# Altium schematic sheet MOTOR.SchDoc
size A4; Author: Khanh BK; Organization: DB Bach Khoa HN; Address1: Bach Khoa- HBT - HN; Address2: khanh.db192932; Address3: Youtube: Đào Bá Khánh; Address4: 0357698570; Revision: 1.0Ver; SheetNumber: 4; SheetTotal: 6
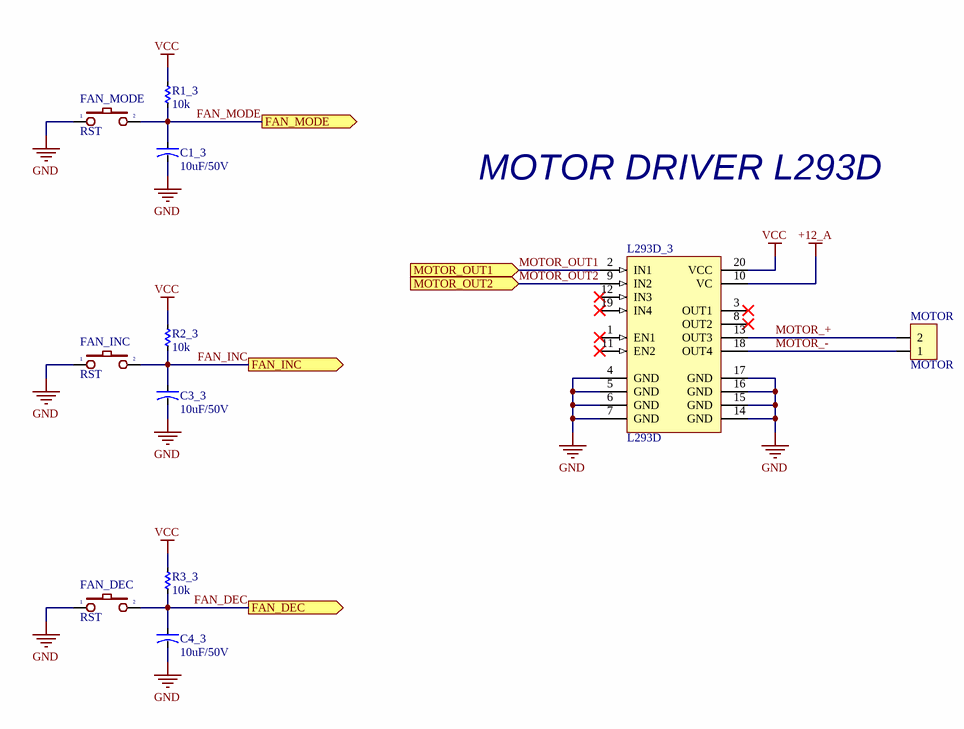
[diagram p0: MOTOR.SchDoc]

## Parts
C1_3  10uF/50V  [CAP-ALU-SMD-5.5x5.5]
C3_3  10uF/50V  [CAP-ALU-SMD-5.5x5.5]
C4_3  10uF/50V  [CAP-ALU-SMD-5.5x5.5]
FAN_DEC  RST  [SW1-SMD]
FAN_INC  RST  [SW1-SMD]
FAN_MODE  RST  [SW1-SMD]
L293D_3  L293D  [SO20]
MOTOR  MOTOR  [Header2]
R1_3  10k  [RES-SMD-0805]
R2_3  10k  [RES-SMD-0805]
R3_3  10k  [RES-SMD-0805]

## Ports
FAN_DEC (out), FAN_INC (out), FAN_MODE (out), MOTOR_OUT1 (in), MOTOR_OUT2 (in)

## Nets
+12_A: L293D_3.10(VC)
GND: C1_3.2 C3_3.2 C4_3.2 FAN_DEC.1 FAN_INC.1 FAN_MODE.1 L293D_3.4(GND) L293D_3.5(GND) L293D_3.6(GND) L293D_3.7(GND) L293D_3.14(GND) L293D_3.15(GND) L293D_3.16(GND) L293D_3.17(GND)
VCC: L293D_3.20(VCC) R1_3.1 R2_3.1 R3_3.1
FAN_DEC: C4_3.1 FAN_DEC.2 R3_3.2 ; port FAN_DEC
FAN_INC: C3_3.1 FAN_INC.2 R2_3.2 ; port FAN_INC
FAN_MODE: C1_3.1 FAN_MODE.2 R1_3.2 ; port FAN_MODE
MOTOR_+: L293D_3.13(OUT3) MOTOR.2
MOTOR_-: L293D_3.18(OUT4) MOTOR.1
MOTOR_OUT1: L293D_3.2(IN1) ; port MOTOR_OUT1
MOTOR_OUT2: L293D_3.9(IN2) ; port MOTOR_OUT2

Not connected (* = marked no-connect by the designer): L293D_3 1(EN1)* 3(OUT1)* 8(OUT2)* 11(EN2)* 12(IN3)* 19(IN4)*

## Notes on the sheet
- MOTOR DRIVER L293D
- Title
- Size:
- Date:
- Author:
- A4
- Time:
- Number:
- Checked:
- Revision:
- Sheet
- Approved:
- of
- File:

## Library data of the parts
C1_3 C3_3 C4_3 = CN-ALU-SMD: Polarized Capacitor (Axial); Published: 8-Jun-2000; LatestRevisionDate: 17-Jul-2002; LatestRevisionNote: Re-released for DXP Platform.; PackageReference: POLAR0.8; Publisher: Altium Limited
FAN_DEC FAN_INC FAN_MODE = SW2: Switch button 2 pin; Value: SW chip 2 pin
L293D_3 = L293D_SMD: Push-Pull Four Channel Driver With Diode; Published: 8-Jun-2000; LatestRevisionDate: 06-Jun-2005; LatestRevisionNote: Stylized 3D Model Added.; DatasheetVersion: Jun-1996; PackageVersion: Apr-1996; PackageReference: DIP16; Publisher: Altium Limited; PackageDescription: DIP; 16 Leads; Row Spacing 7.62 mm; Pitch 2.54 mm; ComponentLink1Description: Manufacturer Link; ComponentLink1URL: http://www.st.com/; ComponentLink2Description: Datasheet; ComponentLink2URL: http://www.st.com/stonline/products/literature/ds/1330/l293d.pdf
MOTOR = Header2: Header IDC, 2 x 1 Pin Vertical 2.54mm Pitch (Non-Boxed, Male); Manufacturer: W¨¹rth Elektronik eiSos GmbH; partNo: 613002143121; ComponentLink1 Description: Manufacturer; ComponentLink2 Description: Datasheet; NoPins: 02; Created Date: 29 March 2013; ComponentLink1URL: http://www.we-online.com; ComponentLink2URL: http://katalog.we-online.de/em/datasheet/6130xx143121.pdf; Created by: Karrer Zheng
R1_3 R2_3 R3_3 = Res-SMD: Resistor; Manufacturer: Generic Components; Class: Passive; Published: 08/06/2000; Publisher: Altium Hobart Technology Centre